# Altium schematic sheet power-management.SchDoc
size 304 x 177 mm
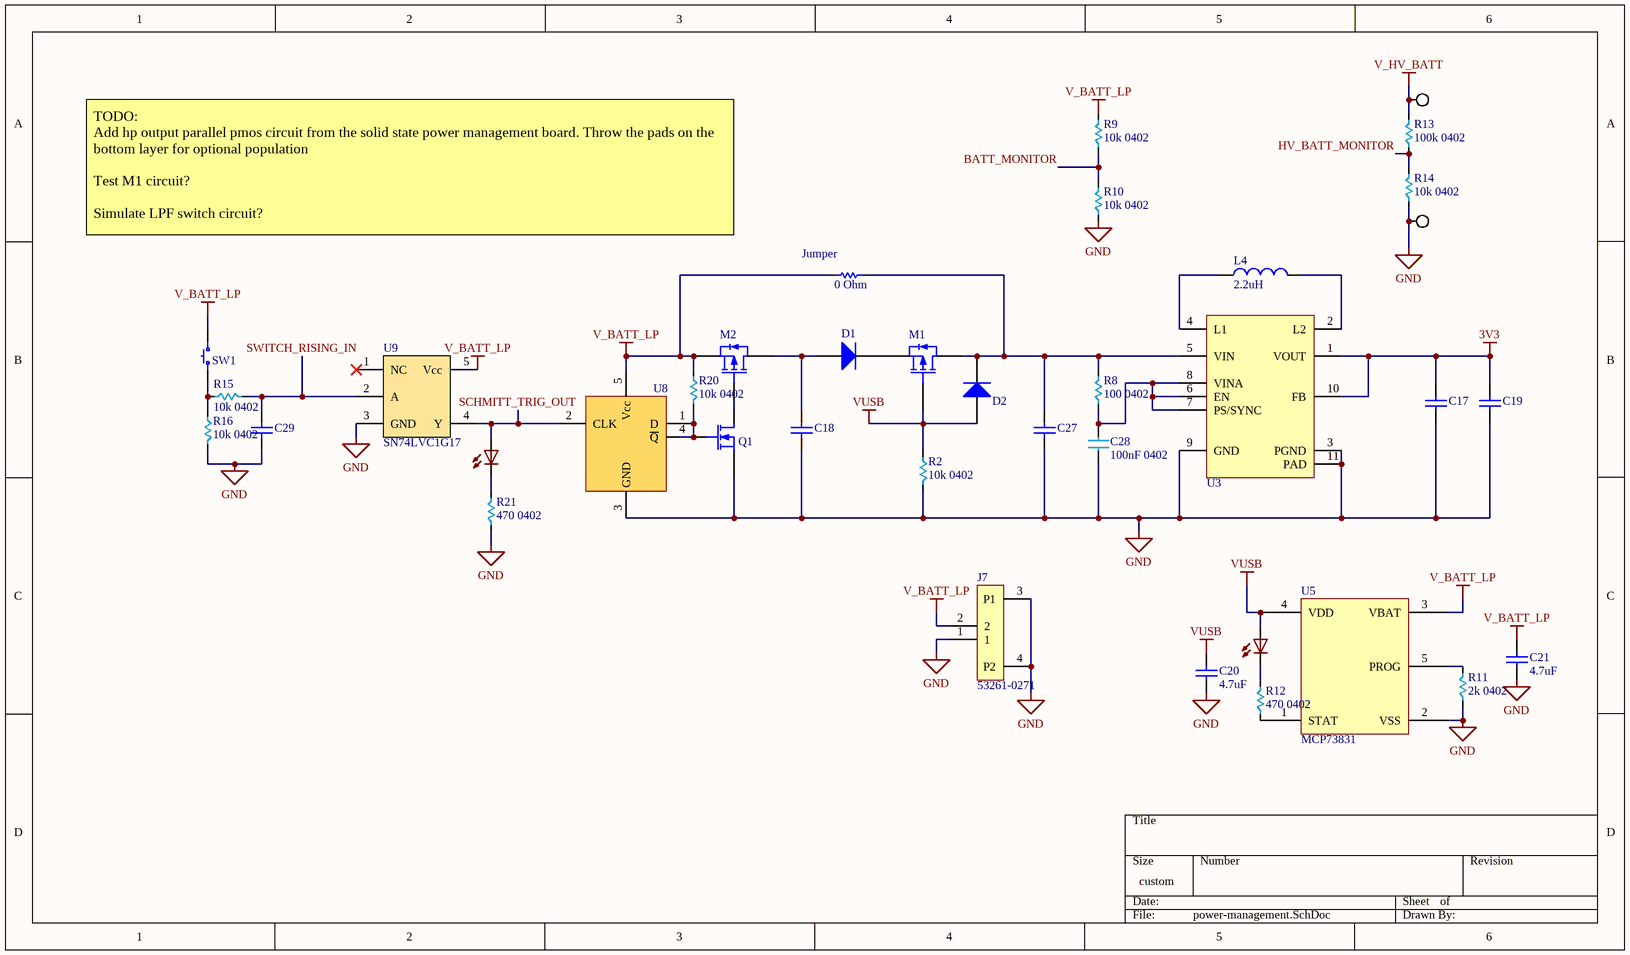
[diagram p0: power-management.SchDoc]

## Parts
0_Ohm  Jumper  [0805-1]
C17  10uF 0603  [C0603]  (value not drawn)
C18  10uF 0603  [C0603]  (value not drawn)
C19  10uF 0603  [C0603]  (value not drawn)
C20  value 4.7uF  [C0603]  (hidden comment: 4.7uF 0603)
C21  value 4.7uF  [C0603]  (hidden comment: 4.7uF 0603)
C27  10uF 0603  [C0603]  (value not drawn)
C28  100nF 0402  [C0402]
C29  10uF 0603  [C0603]  (value not drawn)
D1  NSR0530HT1G  [SOD-323]  (value not drawn)
D2  NSR0530HT1G  [SOD-323]  (value not drawn)
J7  53261-0271  [0532610271]
J18  PAD-SINGLE  [PAD-SINGLE]  (value not drawn)
J19  PAD-SINGLE  [PAD-SINGLE]  (value not drawn)
L4  2.2uH  [L1210]
LED3  LED WHITE 0603  [LED_0603]  (value not drawn)
LED4  LED WHITE 0603  [LED_0603]  (value not drawn)
M1  csd25402q3a  [SON65P330X90-8N]  (value not drawn)
M2  csd25402q3a  [SON65P330X90-8N]  (value not drawn)
Q1  n-mos low power  [SOT-23-3]  (value not drawn)
R2  10k 0402  [R0402]
R8  100 0402  [R0402]
R9  10k 0402  [R0402]
R10  10k 0402  [R0402]
R11  2k 0402  [R0402]
R12  470 0402  [R0402]
R13  100k 0402  [R0402]
R14  10k 0402  [R0402]
R15  10k 0402  [R0402]
R16  10k 0402  [R0402]
R20  10k 0402  [R0402]
R21  470 0402  [R0402]
SW1  EVQ-P7A01P  [EVQ-P7A01P]  (value not drawn)
U3  TPS63001DRCR  [DRC0010J]  (value not drawn)
U5  MCP73831  [SOT-23-5]
U8  SN74LVC1G80DCK  [DCK-SC70-TI]  (value not drawn)
U9  SN74LVC1G17  [DBV-SOT-23]

## Nets
3V3: C17.2 C19.2 U3.1(VOUT) U3.10(FB)
GND: C17.1 C18.1 C19.1 C20.1 C21.1 C27.1 C28.2 C29.2 J7.1 J7.3(P1) J7.4(P2) J19.1 Q1.2(S) R2.1 R10.2 R11.2 R14.2 R16.2 R21.2 U3.3(PGND) U3.9(GND) U3.11(PAD) U5.2(VSS) U8.3(GND) U9.3(GND)
V_BATT_LP: 0_Ohm.1 C21.2 J7.2 M2.3(S) R9.1 R20.2 SW1.2 U5.3(VBAT) U8.5(Vcc) U9.5(Vcc)
V_HV_BATT: J18.1 R13.1
VUSB: C20.2 D2.1(A) LED3.A M1.2(G) R2.2 U5.4(VDD)
BATT_MONITOR: R9.2 R10.1
HV_BATT_MONITOR: R13.2 R14.1
SCHMITT_TRIG_OUT: LED4.A U8.2(CLK) U9.4(Y)
SWITCH_RISING_IN: C29.1 R15.2 U9.2(A)
Net0_Ohm_2: 0_Ohm.2 C27.2 D2.2(K) M1.1(D) R8.1 U3.5(VIN)
NetC18_2: C18.2 D1.1(A) M2.1(D)
NetC28_1: C28.1 R8.2 U3.6(EN) U3.7(PS/SYNC) U3.8(VINA)
NetD1_2: D1.2(K) M1.3(S)
NetL4_1: L4.1 U3.4(L1)
NetL4_2: L4.2 U3.2(L2)
NetLED3_C: LED3.C R12.1
NetLED4_C: LED4.C R21.1
NetM2_2: M2.2(G) Q1.3(D)
NetQ1_1: Q1.1(G) R20.1 U8.1(D) U8.4(~{Q})
NetR11_1: R11.1 U5.5(PROG)
NetR12_2: R12.2 U5.1(STAT)
NetR15_1: R15.1 R16.1 SW1.1

Not connected (* = marked no-connect by the designer): U9 1(NC)*

## Notes on the sheet
- TODO:
  Add hp output parallel pmos circuit from the solid state power management board. Throw the pads on the bottom layer for optional population
  Test M1 circuit?
  Simulate LPF switch circuit?

## Library data of the parts
0_Ohm = R-0-0805: Manufacturer: Panasonic; Manufacturer Part Number: ERJ-6LWJR007V; Value: .007; Description 1: RES 0.007 OHM 5% 1/2W 0805; Resistance: 7mR; Temperature Coefficient: 300ppm/°C; Tolerance: 5%; Max Power Dissipation: 500mW; Footprint: 0805; Supplier 1: Digi-Key; Supplier Part Number 1: P19193DKR-ND; Stock: 3878; Pricing: 1=0.42, 10=0.321, 25=0.2444, 50=0.1816, 100=0.135, 250=0.11404, 500=0.09774, 1000=0.07447 (USD); Case/Package: 0805; Case Code (Metric): 2012; Case Code (Imperial): 0805; Min Operating Temperature: -55°C; Max Operating Temperature: 155°C; Packaging: Tape and Reel; Composition: Thick Film; Number of Terminations: 2; Features: Automotive AEC-Q200; Length: 0.079inch; Height: 0.032inch; Width: 0.049inch
C17-C19 C27 C29 = C-10.0uF-0603
C20 C21 = C-4.7uF-0603: Manufacturer: Samsung; Manufacturer Part Number: CL05F104ZO5NNNC; Description 1: Cap Ceramic 0.1uF 16V Y5V -20% to 80% SMD 0402 85C T/R; Material: Ceramic; Tolerance: 80%; Capacitance: 100nF; Dielectric: Y5V; Voltage Rating: 16V; Description 2: Cap Ceramic 4.7uF 6.3V X5R 20% SMD 0603 85C Paper T/R; Voltage Rating (DC): 6.3V; Published: 8-Jun-2000; LatestRevisionDate: 17-Jul-2002; LatestRevisionNote: Re-released for DXP Platform.; PackageReference: RAD-0.3; Publisher: Altium Limited; Supplier 1: Digi-Key; Supplier Part Number 1: 1276-1004-6-ND; Stock: 8058560; Pricing: 1=0.1, 10=0.024, 100=0.0106, 500=0.00756, 1000=0.00595, 2500=0.00541, 5000=0.00497 (USD); Mount: Surface Mount; Case/Package: 0402; Case Code (Metric): 1005; Case Code (Imperial): 0402; Contact Plating: Tin; Min Operating Temperature: -30°C; Max Operating Temperature: 85°C; Packaging: Tape and Reel; Length: 1mm; Height: 0.5mm; Width: 0.02inch; Thickness: 0.022inch; Depth: 0.5mm; Radiation Hardening: No; ComponentLink1URL: http://www1.futureelectronics.com/doc/SAMSUNG/CL05F104ZO5NNNC.pdf; ComponentLink1Description: http://www1.futureelectronics.com/doc/SAMSUNG/CL05F104ZO5NNNC.pdf; ComponentLink2URL: https://www.verical.com/server-webapp/html/getDatasheet?partID=358403; ComponentLink2Description: https://www.verical.com/server-webapp/html/getDatasheet?partID=358403; ComponentLink3URL: https://produktinfo.conrad.com/datenblaetter/450000-474999/458504-da-01-en-VS_KONDENSATOR_0402.pdf; ComponentLink3Description: https://produktinfo.conrad.com/datenblaetter/450000-474999/458504-da-01-en-VS_KONDENSATOR_0402.pdf; Supplier 2: Digi-Key; Supplier Part Number 2: 1276-1907-6-ND; Manufacturer Part Number 2: CL10A475MQ8NNNC; Package Quantity: 4000; Lead Free: Lead Free; ComponentLink4URL: http://www.samsungsem.com/kr/support/product-search/mlcc/CL10A475MQ8NNNC.jsp?src-supplier=Digi-Key; ComponentLink4Description: http://www.samsungsem.com/kr/support/product-search/mlcc/CL10A475MQ8NNNC.jsp?src-supplier=Digi-Key; ComponentLink5URL: https://www.verical.com/server-webapp/html/getDatasheet?partID=358407&src-supplier=Verical; ComponentLink5Description: https://www.verical.com/server-webapp/html/getDatasheet?partID=358407&src-supplier=Verical; ComponentLink6URL: http://www1.futureelectronics.com/doc/SAMSUNG%20PASSIVE/CL05B104KQ5NNNC.pdf?src-supplier=Future+Electronics; ComponentLink6Description: http://www1.futureelectronics.com/doc/SAMSUNG%20PASSIVE/CL05B104KQ5NNNC.pdf?src-supplier=Future+Electronics
C28 = C0402-100nF
D1 D2 = NSR0530HT1G: DIODE SCHOTTKY 30V 500MA SOD323; Manufacturer: ON Semiconductor; Forward Voltage: 620mV; Peak Reverse Current: 200uA; Element Configuration: Single; Supplier 1: Digi-Key; Supplier Part Number 1: NSR0530HT1GOSCT-ND; Manufacturer Part Number: NSR0530HT1G; Stock 1: 163499; Pricing 1: 1=0.16, 10=0.149, 100=0.081, 500=0.04986, 1000=0.03399 (USD); Mount: Surface Mount; Case/Package: SOD; Number of Pins: 2; Contact Plating: Tin; Min Operating Temperature: -55°C; Max Operating Temperature: 150°C; Packaging: Cut Tape; Average Rectified Current: 500mA; Max Repetitive Reverse Voltage (Vrrm): 30V; Forward Current: 500mA; Max Reverse Voltage (DC): 30V; REACH SVHC: No SVHC; Lead Free: Lead Free
J7 = 53261-0271: Headers & Wire Housings 1.25MM HDR 2 CKT Right-Angle; Manufacturer: Molex; Gender: Male; Voltage Rating: 125V; Number of Positions: 2; Current Rating: 1A; Contact Resistance: 20mR; Insulation Resistance: 100MR; Glow Wire Compliant: Non-compliant; Supplier 1: Digi-Key; Supplier Part Number 1: WM7620TR-ND; Manufacturer Part Number 1: 53261-0271; Description 1: Headers & Wire Housings 1.25MM HDR 2 CKT Right-Angle; Stock: 85000; Pricing: 1000=0.4904, 2000=0.45975, 3000=0.44443, 5000=0.4291, 10000=0.40765, 25000=0.39845 (USD); Mount: Surface Mount; Color: Beige; Housing Material: Thermoplastic; Contact Material: Bronze,Tin; Contact Plating: Tin; Min Operating Temperature: -40°C; Max Operating Temperature: 85°C; Packaging: Tape and Reel; Termination: SMD/SMT; Number of Rows: 1; Number of Contacts: 2; Orientation: Right Angle; Package Quantity: 1000; Voltage Rating (AC): 125V; Number of Circuits: 2; Voltage Rating (DC): 125V; Working Voltage: 125V; Pitch: 1.25mm; Lead Pitch: 1.25mm; Radiation Hardening: No; REACH SVHC: Unknown; Lead Free: Lead Free; Flammability Rating: UL94 V-0; ComponentLink1URL: http://uk.rs-online.com/webdocs/13c4/0900766b813c44b8.pdf; ComponentLink1Description: http://uk.rs-online.com/webdocs/13c4/0900766b813c44b8.pdf; ComponentLink2URL: http://www.molex.com/webdocs/datasheets/pdf/en-us/0532610271_PCB_HEADERS.pdf; ComponentLink2Description: http://www.molex.com/webdocs/datasheets/pdf/en-us/0532610271_PCB_HEADERS.pdf; ComponentLink3URL: http://www.alliedelec.com/m/d/74d14d19c60ab078e4881c4c1bd42ef7.pdf; ComponentLink3Description: http://www.alliedelec.com/m/d/74d14d19c60ab078e4881c4c1bd42ef7.pdf; ComponentLink4URL: http://www.farnell.com/datasheets/2697765.pdf; ComponentLink4Description: http://www.farnell.com/datasheets/2697765.pdf; ComponentLink5URL: http://www.farnell.com/datasheets/2144535.pdf; ComponentLink5Description: http://www.farnell.com/datasheets/2144535.pdf; ComponentLink6URL: http://www.farnell.com/datasheets/1626147.pdf; ComponentLink6Description: http://www.farnell.com/datasheets/1626147.pdf; ComponentLink7URL: http://www.mouser.com/ds/2/276/0532610271_PCB_HEADERS-171053.pdf; ComponentLink7Description: http://www.mouser.com/ds/2/276/0532610271_PCB_HEADERS-171053.pdf; ComponentLink8URL: http://www.farnell.com/datasheets/2038817.pdf; ComponentLink8Description: http://www.farnell.com/datasheets/2038817.pdf; ComponentLink9URL: http://www.jameco.com/Jameco/Products/ProdDS/1932547.pdf; ComponentLink9Description: http://www.jameco.com/Jameco/Products/ProdDS/1932547.pdf
J18 J19 = PAD-SINGLE: Single Thru Hole Pad
L4 = DFE322520FD-2R2M=P2: 2.2uH 1210
LED3 LED4 = LED_ESML0603: LED   Source: http://www.osram.convergy.de   Source: www.luxeon.com   Source: www.kingbright.com; Manufacturer: Dialight; Manufacturer Part Number: 5988070107F; Description 1: DIALIGHT - 5988070107F - LED, 0603, GREEN, 20MCD, 566NM; Color: Green; Lens Color: Colorless,Clear; Forward Voltage: 2V; Forward Current: 20mA; Wavelength: 570nm; Luminous Intensity: 20mcd; Viewing Angle: 140°; Lens Style: Flat,Rectangular,Diffused,Colorless,Clear; Dominant Wavelength: 568nm; Number of Elements: 1; Power Dissipation: 60mW; Reverse Voltage: 5V; Lens Transparency: Clear; Lens Size: 0.8mm; SPICEMODEL: NONE; SPICEPREFIX: D; SPICETYPE: diode; Supplier 1: Digi-Key; Supplier Part Number 1: 350-2035-6-ND; Stock: 221494; Pricing: 1=0.48, 10=0.346, 25=0.2652, 100=0.1731, 250=0.12692, 500=0.1077, 1000=0.08846 (USD); Mount: Surface Mount; Case/Package: 0603; Number of Pins: 2; Case Code (Metric): 1608; Case Code (Imperial): 0603; Min Operating Temperature: -30°C; Max Operating Temperature: 100°C; Package Quantity: 4000; Packaging: Tape and Reel; Illumination Color: Green; Test Current: 20mA; Number of LEDs: 1; Length: 1.6mm; Height: 0.7mm; Depth: 0.8mm; Width: 0.8mm; Radiation Hardening: No; Lead Free: Lead Free; REACH SVHC: No SVHC; ComponentLink1URL: http://www.mouser.com/ds/2/109/SMT_selector_guide-267443.pdf?src-supplier=Mouser; ComponentLink1Description: http://www.mouser.com/ds/2/109/SMT_selector_guide-267443.pdf?src-supplier=Mouser; ComponentLink2URL: http://uk.rs-online.com/webdocs/0ae2/0900766b80ae2975.pdf?src-supplier=RSComponents; ComponentLink2Description: http://uk.rs-online.com/webdocs/0ae2/0900766b80ae2975.pdf?src-supplier=RSComponents; ComponentLink3URL: http://www.farnell.com/datasheets/1720200.pdf?src-supplier=Element14; ComponentLink3Description: http://www.farnell.com/datasheets/1720200.pdf?src-supplier=Element14; ComponentLink4URL: https://media.digikey.com/pdf/Data%20Sheets/Dialight%20PDFs/598_Series_0603_Pkg.pdf?src-supplier=Digi-Key; ComponentLink4Description: https://media.digikey.com/pdf/Data%20Sheets/Dialight%20PDFs/598_Series_0603_Pkg.pdf?src-supplier=Digi-Key; ComponentLink5URL: http://www.farnell.com/datasheets/1484480.pdf?src-supplier=Element14; ComponentLink5Description: http://www.farnell.com/datasheets/1484480.pdf?src-supplier=Element14; ComponentLink6URL: https://www.alliedelec.com/m/d/745256ca487aea7b70ea31e2d673d5bb.pdf?src-supplier=Allied+Electronics; ComponentLink6Description: https://www.alliedelec.com/m/d/745256ca487aea7b70ea31e2d673d5bb.pdf?src-supplier=Allied+Electronics; ComponentLink7URL: http://www.onlinecomponents.com/productFiles/mf-DIA/mdei5980603.pdf?src-supplier=Onlinecomponents.com; ComponentLink7Description: http://www.onlinecomponents.com/productFiles/mf-DIA/mdei5980603.pdf?src-supplier=Onlinecomponents.com; ComponentLink8URL: https://www.verical.com/server-webapp/html/getDatasheet?partID=146438&src-supplier=Verical; ComponentLink8Description: https://www.verical.com/server-webapp/html/getDatasheet?partID=146438&src-supplier=Verical; ComponentLink9URL: http://www.dialight.com/Assets/Brochures_And_Catalogs/Indication/SMT_selector_guide.pdf?src-supplier=Future+Electronics; ComponentLink9Description: http://www.dialight.com/Assets/Brochures_And_Catalogs/Indication/SMT_selector_guide.pdf?src-supplier=Future+Electronics
Q1 = NDS351N: Manufacturer: ON Semiconductor / Fairchild; Rds On Max: 160mR; Input Capacitance: 140pF; Drain to Source Voltage (Vdss): 30V; Continuous Drain Current (ID): 1.1A; Max Power Dissipation: 460mW; Gate to Source Voltage (Vgs): 20V; Power Dissipation: 500mW; Element Configuration: Single; Rise Time: 16ns; Turn-Off Delay Time: 26ns; Number of Elements: 1; Turn-On Delay Time: 9ns; Supplier 1: Mouser; Manufacturer Part Number: NDS351N; Stock 1: 2166; Pricing 1: 1=0.46, 10=0.383, 50=0.383, 100=0.234, 1000=0.181, 10000=0.144 (USD); Mount: Surface Mount; Case/Package: TO-236-3; Number of Pins: 3; Weight: 0.03g; Min Operating Temperature: -55°C; Max Operating Temperature: 150°C; Package Quantity: 1; Packaging: Tape and Reel; Drain to Source Breakdown Voltage: 30V; Drain to Source Resistance: 160mR; Fall Time: 16ns; Current Rating: 1.1A; Voltage Rating (DC): 30V; Radiation Hardening: No; Lead Free: Contains Lead; ComponentLink1URL: https://www.verical.com/server-webapp/html/getDatasheet?partID=96049&src-supplier=Verical; ComponentLink1Description: https://www.verical.com/server-webapp/html/getDatasheet?partID=96049&src-supplier=Verical; ComponentLink2URL: https://www.fairchildsemi.com/package-drawings/MA/MA03B.pdf?src-supplier=Digi-Key; ComponentLink2Description: https://www.fairchildsemi.com/package-drawings/MA/MA03B.pdf?src-supplier=Digi-Key; ComponentLink3URL: http://www.fairchildsemi.com/ds/ND/NDS351N.pdf?src-supplier=Avnet+Europe; ComponentLink3Description: http://www.fairchildsemi.com/ds/ND/NDS351N.pdf?src-supplier=Avnet+Europe; ComponentLink4URL: http://www.fairchildsemi.com/ds/ND/NDS351N.pdf?src-supplier=Avnet; ComponentLink4Description: http://www.fairchildsemi.com/ds/ND/NDS351N.pdf?src-supplier=Avnet
R2 R9 R10 R14-R16 R20 = R-10k-0402
R8 = R-100-0402
R11 = R-2k-0402
R12 R21 = R-470-0402: Manufacturer: Yageo; Manufacturer Part Number: RC0402JR-07470RL; Description 1: RES SMD 470 OHM 5% 1/16W 0402; Tolerance: 5%; Voltage Rating: 50V; Resistance: 470R; Power Rating: 62.5mW; Temperature Coefficient: 100ppm/°C; Max Power Dissipation: 63mW; Supplier 1: Digi-Key; Supplier Part Number 1: 311-470JRDKR-ND; Stock: 2903670; Pricing: 1=0.1, 10=0.013, 100=0.0055, 1000=0.00245, 2500=0.00212, 5000=0.00176 (USD); Case/Package: 0402; Case Code (Metric): 1005; Case Code (Imperial): 0402; Min Operating Temperature: -55°C; Max Operating Temperature: 155°C; Packaging: Tape and Reel; Package Quantity: 1; Termination: SMD/SMT; Composition: Thick Film; Features: Moisture Resistant; Number of Terminations: 2; Military Standard: Not; Working Voltage: 50V; Length: 1mm; Height: 0.016inch; Width: 0.02inch; Depth: 0.5mm; REACH SVHC: Unknown; Lead Free: Lead Free; ComponentLink1URL: http://www.yageo.com/documents/recent/PYu-RC_Group_51_RoHS_L_10.pdf?src-supplier=Digi-Key; ComponentLink1Description: http://www.yageo.com/documents/recent/PYu-RC_Group_51_RoHS_L_10.pdf?src-supplier=Digi-Key; ComponentLink2URL: http://www.farnell.com/datasheets/1018594.pdf?src-supplier=Element14; ComponentLink2Description: http://www.farnell.com/datasheets/1018594.pdf?src-supplier=Element14; ComponentLink3URL: http://www.mouser.com/ds/2/447/PYu-RC0402_51_RoHS_L_6_r-8721.pdf?src-supplier=Mouser; ComponentLink3Description: http://www.mouser.com/ds/2/447/PYu-RC0402_51_RoHS_L_6_r-8721.pdf?src-supplier=Mouser
R13 = R-100k-0402
SW1 = EVQ-P7A01P: SWITCH TACTILE SPST-NO 50MA 32V; Manufacturer: ITT C&K; Manufacturer Part Number: KMR742NGLFS; Mechanical Life: 200000Cycles; Illumination Type: Non-Illuminated; Operating Force: 400gf; Throw Configuration: SPST; Switch Function: Off-Mom; Actuator Type: Standard; Ratings: IP67,Waterproof,Dust Tight; Supplier 1: Digi-Key; Supplier Part Number 1: CKN10689CT-ND; Stock 1: 44684; Pricing 1: 1=0.35, 10=0.343, 25=0.3304, 50=0.3182, 100=0.306, 250=0.28152, 500=0.24482, 1000=0.20809 (USD); Mount: Surface Mount; Min Operating Temperature: -40°C; Max Operating Temperature: 85°C; Packaging: Tape and Reel; Termination: Gull Wing
U8 = SN74LVC1G80DCK: Flip Flop Inverted Output
U9 = SN74LVC1G17: TEXAS INSTRUMENTS - SN74LVC1G17DBVR - Buffer, 74LVC1G17, 1.65 V to 5.5 V, SOT-23-5; Logic Function: Schmitt Trigger,Buffer; Max Supply Voltage: 5.5V; Min Supply Voltage: 1.65V; Number of Elements: 1; Low Level Output Current: 32mA; Polarity: Non-Inverting; Propagation Delay: 5ns; High Level Output Current: -32mA; Turn-On Delay Time: 11ns; Quiescent Current: 1.5uA; Schmitt Trigger Input: Yes; Supplier 1: Digi-Key; Manufacturer: Texas Instruments; RoHS: Yes; Category: Buffers, Drivers and Transceivers; Stock 1: 149811; Pricing 1: 1=0.32000, 10=0.26200, 25=0.21960, 100=0.13900, 250=0.10728, 500=0.09142, 1000=0.06217 (USD); Mount: Surface Mount; Case/Package: SOT-23; Number of Pins: 5; Contact Plating: Tin,Matte; Min Operating Temperature: -40°C; Max Operating Temperature: 125°C; Packaging: Tape and Reel; Package Quantity: 3000; Number of Bits per Element: 1; Number of Bits: 1; Number of Input Lines: 1; Number of Output Lines: 1; Number of Outputs: 1; Number of Channels: 1; Number of Inputs: 1; Number of Gates: 1; Termination: SMD/SMT; Length: 2.9mm; Width: 1.6mm; Height: 1.15mm; Radiation Hardening: No; Lead Free: Lead Free; RoHS Compliant: Yes; REACH SVHC: No SVHC; ComponentLink1URL: https://datasheet.ciiva.com/34301/756684-34301476.pdf?src-supplier=Jameco; ComponentLink1Description: https://datasheet.ciiva.com/34301/756684-34301476.pdf?src-supplier=Jameco; ComponentLink2URL: https://datasheet.ciiva.com/15094/getdatasheetpartid-189714-15094971.pdf?src-supplier=Verical; ComponentLink2Description: https://datasheet.ciiva.com/15094/getdatasheetpartid-189714-15094971.pdf?src-supplier=Verical; ComponentLink3URL: https://datasheet.ciiva.com/1833/sn74lvc1g17-1833621.pdf?src-supplier=Digi-Key; ComponentLink3Description: https://datasheet.ciiva.com/1833/sn74lvc1g17-1833621.pdf?src-supplier=Digi-Key; ComponentLink4URL: https://datasheet.ciiva.com/1833/sn74lvc1g17-1833622.pdf?src-supplier=Digi-Key; ComponentLink4Description: https://datasheet.ciiva.com/1833/sn74lvc1g17-1833622.pdf?src-supplier=Digi-Key; ComponentLink5URL: https://datasheet.ciiva.com/1833/sn74lvc1g17-1833623.pdf?src-supplier=Digi-Key; ComponentLink5Description: https://datasheet.ciiva.com/1833/sn74lvc1g17-1833623.pdf?src-supplier=Digi-Key; ComponentLink6URL: https://datasheet.ciiva.com/28594/1772570-28594805.pdf?src-supplier=Element14; ComponentLink6Description: https://datasheet.ciiva.com/28594/1772570-28594805.pdf?src-supplier=Element14; ComponentLink7URL: https://datasheet.ciiva.com/7744/1811088-7744197.pdf?src-supplier=Element14; ComponentLink7Description: https://datasheet.ciiva.com/7744/1811088-7744197.pdf?src-supplier=Element14; ComponentLink8URL: https://datasheet.ciiva.com/48702/001073974-da-01-en-ic-buffer-s-sn74lvc1g17dbvr-sot-23-5-tid-48702678.pdf?src-supplier=Conrad; ComponentLink8Description: https://datasheet.ciiva.com/48702/001073974-da-01-en-ic-buffer-s-sn74lvc1g17dbvr-sot-23-5-tid-48702678.pdf?src-supplier=Conrad; Supplier Part Number 1: 296-11933-1-ND; Manufacturer Part Number: SN74LVC1G17DBVR